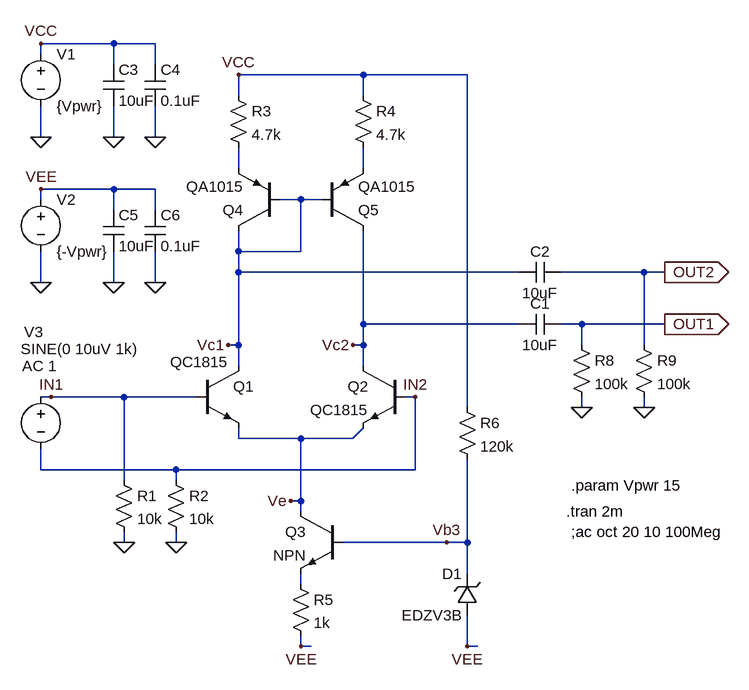
[diagram p0: schematic Diff_Amp_CurrentMirror.asc]
Diff_Amp_CurrentMirror.asc, the LTspice schematic file:
Version 4
SHEET 1 1100 680
WIRE -32 -384 -144 -384
WIRE 32 -384 -32 -384
WIRE -144 -368 -144 -384
WIRE -32 -352 -32 -384
WIRE 32 -352 32 -384
WIRE 352 -336 160 -336
WIRE 512 -336 352 -336
WIRE 160 -304 160 -336
WIRE 352 -304 352 -336
WIRE -144 -240 -144 -288
WIRE -32 -240 -32 -288
WIRE 32 -240 32 -288
WIRE 160 -192 160 -224
WIRE 352 -192 352 -224
WIRE -32 -160 -144 -160
WIRE 32 -160 -32 -160
WIRE -144 -144 -144 -160
WIRE 256 -144 224 -144
WIRE 288 -144 256 -144
WIRE -32 -128 -32 -160
WIRE 32 -128 32 -160
WIRE 160 -64 160 -96
WIRE 256 -64 256 -144
WIRE 256 -64 160 -64
WIRE 160 -32 160 -64
WIRE 592 -32 160 -32
WIRE 784 -32 656 -32
WIRE 816 -32 784 -32
WIRE -144 -16 -144 -64
WIRE -32 -16 -32 -64
WIRE 32 -16 32 -64
WIRE 352 48 352 -96
WIRE 592 48 352 48
WIRE 688 48 656 48
WIRE 816 48 688 48
WIRE 160 80 160 -32
WIRE 160 80 144 80
WIRE 352 80 352 48
WIRE 352 80 336 80
WIRE 688 80 688 48
WIRE 784 80 784 -32
WIRE 160 112 160 80
WIRE 352 112 352 80
WIRE -128 160 -144 160
WIRE -16 160 -128 160
WIRE 96 160 -16 160
WIRE 432 160 416 160
WIRE 512 176 512 -336
WIRE 688 176 688 160
WIRE 784 176 784 160
WIRE 160 224 160 208
WIRE 256 224 160 224
WIRE 336 224 352 208
WIRE 336 224 256 224
WIRE -144 272 -144 240
WIRE 64 272 -144 272
WIRE 432 272 432 160
WIRE 432 272 64 272
WIRE -16 288 -16 160
WIRE 64 288 64 272
WIRE 256 320 256 224
WIRE 256 320 240 320
WIRE 256 336 256 320
WIRE -16 384 -16 368
WIRE 64 384 64 368
WIRE 480 384 320 384
WIRE 512 384 512 256
WIRE 512 384 480 384
WIRE 512 432 512 384
WIRE 256 448 256 432
WIRE 256 544 256 528
WIRE 272 544 256 544
WIRE 512 544 512 496
WIRE 528 544 512 544
FLAG -16 384 0
FLAG 64 384 0
FLAG 160 -336 VCC
FLAG 256 544 VEE
FLAG 512 544 VEE
FLAG 688 176 0
FLAG 784 176 0
FLAG 816 48 OUT1
IOPIN 816 48 Out
FLAG 816 -32 OUT2
IOPIN 816 -32 Out
FLAG -144 -240 0
FLAG -144 -16 0
FLAG -144 -384 VCC
FLAG -144 -160 VEE
FLAG -128 160 IN1
FLAG 432 160 IN2
FLAG 480 384 Vb3
FLAG 240 320 Ve
FLAG 144 80 Vc1
FLAG 336 80 Vc2
FLAG -32 -240 0
FLAG 32 -240 0
FLAG -32 -16 0
FLAG 32 -16 0
SYMBOL npn 96 112 R0
WINDOW 3 -41 -6 Left 2
SYMATTR Value QC1815
SYMATTR InstName Q1
SYMBOL npn 416 112 M0
SYMATTR InstName Q2
SYMATTR Value QC1815
SYMBOL npn 320 336 M0
SYMATTR InstName Q3
SYMBOL res -32 272 R0
SYMATTR InstName R1
SYMATTR Value 10k
SYMBOL res 48 272 R0
SYMATTR InstName R2
SYMATTR Value 10k
SYMBOL res 144 -320 R0
SYMATTR InstName R3
SYMATTR Value 4.7k
SYMBOL res 336 -320 R0
SYMATTR InstName R4
SYMATTR Value 4.7k
SYMBOL cap 656 32 R90
WINDOW 0 0 32 VBottom 2
WINDOW 3 32 32 VTop 2
SYMATTR InstName C1
SYMATTR Value 10uF
SYMBOL cap 656 -48 R90
WINDOW 0 0 32 VBottom 2
WINDOW 3 32 32 VTop 2
SYMATTR InstName C2
SYMATTR Value 10uF
SYMBOL res 240 432 R0
SYMATTR InstName R5
SYMATTR Value 1k
SYMBOL res 496 160 R0
SYMATTR InstName R6
SYMATTR Value 120k
SYMBOL res 672 64 R0
SYMATTR InstName R8
SYMATTR Value 100k
SYMBOL res 768 64 R0
SYMATTR InstName R9
SYMATTR Value 100k
SYMBOL voltage -144 -384 R0
WINDOW 123 0 0 Left 2
WINDOW 39 0 0 Left 2
SYMATTR InstName V1
SYMATTR Value {Vpwr}
SYMBOL voltage -144 -160 R0
WINDOW 123 0 0 Left 2
WINDOW 39 0 0 Left 2
SYMATTR InstName V2
SYMATTR Value {-Vpwr}
SYMBOL voltage -144 144 R0
WINDOW 0 -26 -84 Left 2
WINDOW 3 -31 -58 Left 2
WINDOW 123 -29 -32 Left 2
WINDOW 39 0 0 Left 2
SYMATTR InstName V3
SYMATTR Value SINE(0 10uV 1k)
SYMATTR Value2 AC 1
SYMBOL cap -48 -352 R0
SYMATTR InstName C3
SYMATTR Value 10uF
SYMBOL cap 16 -352 R0
SYMATTR InstName C4
SYMATTR Value 0.1uF
SYMBOL cap -48 -128 R0
SYMATTR InstName C5
SYMATTR Value 10uF
SYMBOL cap 16 -128 R0
SYMATTR InstName C6
SYMATTR Value 0.1uF
SYMBOL pnp 224 -96 R180
SYMATTR InstName Q4
SYMATTR Value QA1015
SYMBOL pnp 288 -96 M180
SYMATTR InstName Q5
SYMATTR Value QA1015
SYMBOL zener 528 496 R180
WINDOW 0 24 64 Left 2
WINDOW 3 24 0 Left 2
SYMATTR InstName D1
SYMATTR Value EDZV3B
TEXT 664 336 Left 2 !.tran 2m
TEXT 672 368 Left 2 !;ac oct 20 10 100Meg
TEXT 672 296 Left 2 !.param Vpwr 15

The netlist it stands for:
* Diff_Amp_CurrentMirror.asc
Q1 Vc1 IN1 Ve 0 QC1815
Q2 Vc2 IN2 Ve 0 QC1815
Q3 Ve Vb3 N003 0 NPN
R1 IN1 0 10k
R2 IN2 0 10k
R3 VCC N001 4.7k
R4 VCC N002 4.7k
C1 OUT1 Vc2 10uF
C2 OUT2 Vc1 10uF
R5 N003 VEE 1k
R6 VCC Vb3 120k
R8 OUT1 0 100k
R9 OUT2 0 100k
V1 VCC 0 {Vpwr}
V2 VEE 0 {-Vpwr}
V3 IN1 IN2 SINE(0 10uV 1k) AC 1
C3 VCC 0 10uF
C4 VCC 0 0.1uF
C5 VEE 0 10uF
C6 VEE 0 0.1uF
Q4 Vc1 Vc1 N001 0 QA1015
Q5 Vc2 Vc1 N002 0 QA1015
D1 VEE Vb3 EDZV3B
.model D D
.lib standard.dio
.model NPN NPN
.model PNP PNP
.lib standard.bjt
.tran 2m
;ac oct 20 10 100Meg
.param Vpwr 15
.backanno
.end